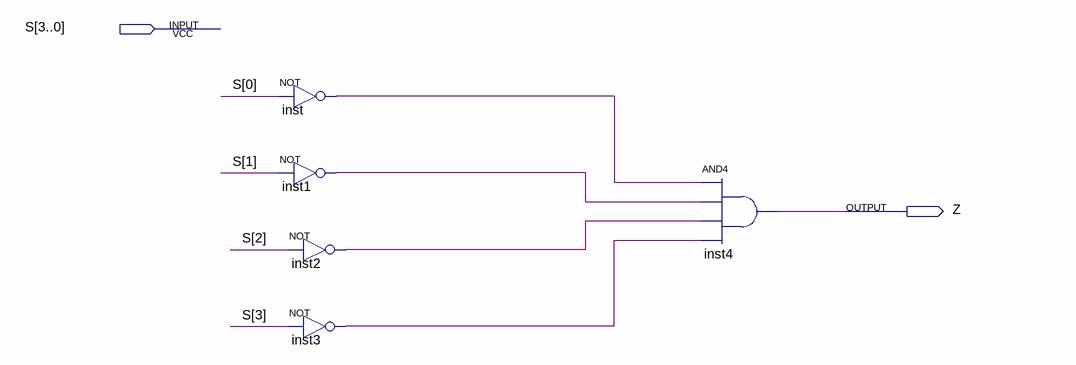
[diagram p0: schematic sheet]
// Quartus schematic DetectorCero.bdf as structural Verilog: 5 symbols, 2 pins
module DetectorCero (
  input  [3:0] S,
  output Z
);

  wire inst1_out, inst2_out, inst3_out, inst_out;

  not inst (inst_out, S[0]);
  not inst1 (inst1_out, S[1]);
  not inst2 (inst2_out, S[2]);
  not inst3 (inst3_out, S[3]);
  and inst4 (Z, inst_out, inst1_out, inst2_out, inst3_out);
endmodule
